# EAGLE design TinyGame RC1_Jig (EAGLE 7.7.0)
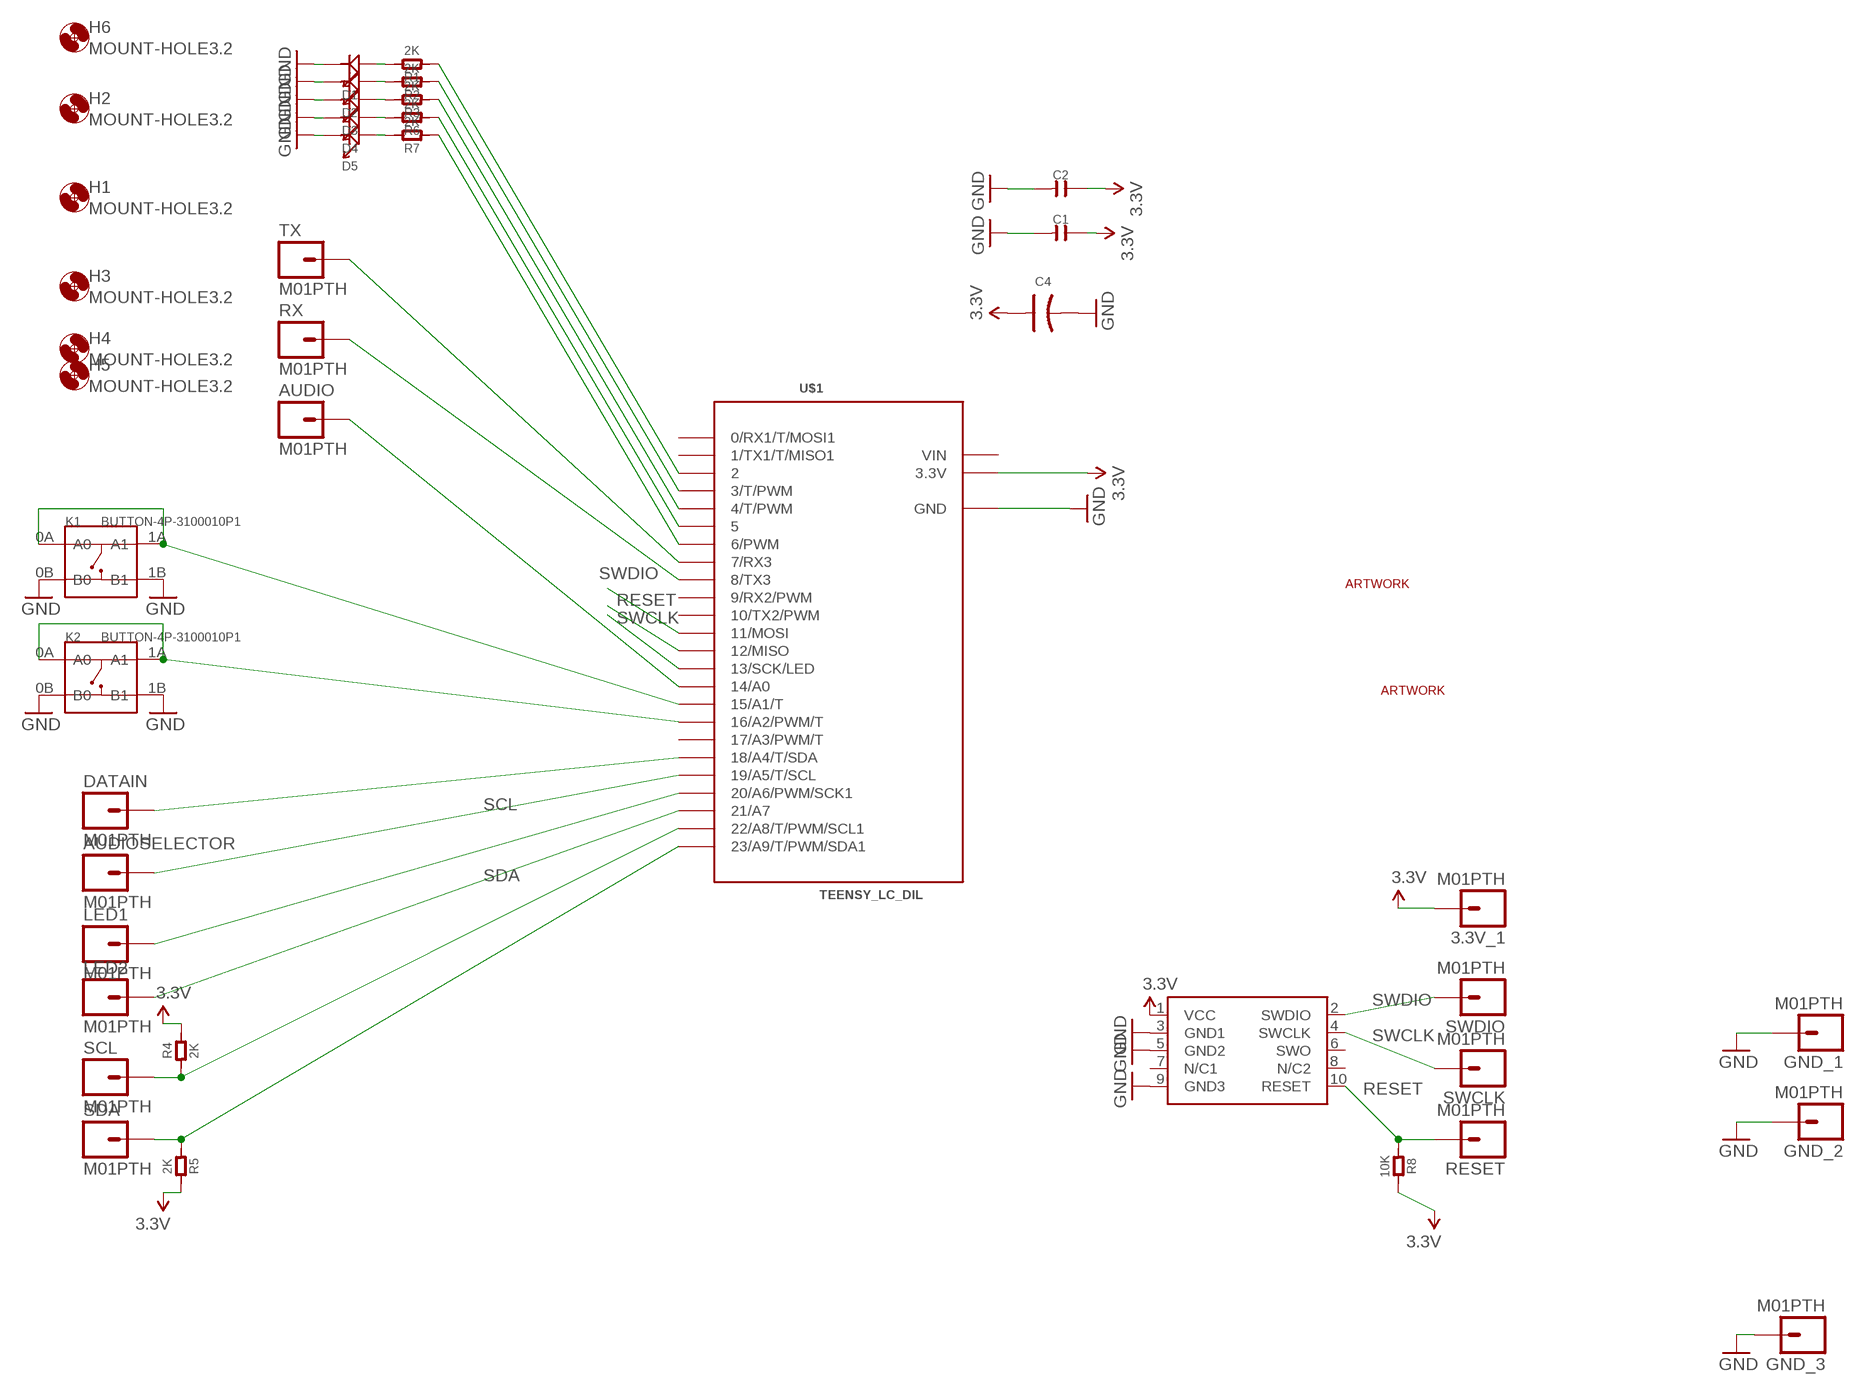
[diagram p0: schematic, sheet 1]

## Parts
3.3V_1  M01PTH  [1X01]
AUDIO  M01PTH  [1X01]
AUDIOSELECTOR  M01PTH  [1X01]
C1  C-0603  [C0603]
C2  C-0603  [C0603]
C4  C-POLAR-A  [AVX-A]
D1  LED  [LED0603]
D2  LED  [LED0603]
D3  LED  [LED0603]
D4  LED  [LED0603]
D5  LED  [LED0603]
DATAIN  M01PTH  [1X01]
GND_1  M01PTH  [1X01]
GND_2  M01PTH  [1X01]
GND_3  M01PTH  [1X01]
H1  MOUNT-HOLE3.2  [3,2]
H2  MOUNT-HOLE3.2  [3,2]
H3  MOUNT-HOLE3.2  [3,2]
H4  MOUNT-HOLE3.2  [3,2]
H5  MOUNT-HOLE3.2  [3,2]
H6  MOUNT-HOLE3.2  [3,2]
K1  BUTTON-4P-3100010P1  [4P-SMD-6.0X6.0X5.0H]
K2  BUTTON-4P-3100010P1  [4P-SMD-6.0X6.0X5.0H]
LED1  M01PTH  [1X01]
LED2  M01PTH  [1X01]
R1  2K  R-0603  [R0603]
R2  2K  R-0603  [R0603]
R3  2K  R-0603  [R0603]
R4  2K  R-0603  [R0603]
R5  2K  R-0603  [R0603]
R6  2K  R-0603  [R0603]
R7  2K  R-0603  [R0603]
R8  10K  R-0603  [R0603]
RESET  M01PTH  [1X01]
RX  M01PTH  [1X01]
SCL  M01PTH  [1X01]
SDA  M01PTH  [1X01]
SWCLK  M01PTH  [1X01]
SWD1  CORTEX_SWDVERT  [SWD_VERTICAL]
SWDIO  M01PTH  [1X01]
TX  M01PTH  [1X01]
U$1  TEENSY_LC_DIL  [TEENSY_3.0-3.2&LC_DIL]
U$2  TINRS_ARTWORKLOGO  [TINRSLOGO]
U$3  TINRS_ARTWORKROCKET  [TINRS_ROCKET]

## Nets
3.3V: 3.3V_1.1 C1.2 C2.2 C4.+ R4.2 R5.2 R8.2 SWD1.1(VCC) U$1.3.3V
GND [GND]: C1.1 C2.1 C4.- D1.- D2.- D3.- D4.- D5.- GND_1.1 GND_2.1 GND_3.1 K1.0B(B0) K1.1B(B1) K2.0B(B0) K2.1B(B1) SWD1.3(GND1) SWD1.5(GND2) SWD1.9(GND3) U$1.AGND(GND) U$1.GND
N$2: TX.1 U$1.7(7/RX3)
N$3: RX.1 U$1.8(8/TX3)
N$4: AUDIO.1 U$1.14/A0
N$6: LED2.1 U$1.21/A7
N$8: LED1.1 U$1.20/A6(20/A6/PWM/SCK1)
N$9: AUDIOSELECTOR.1 U$1.19/A5(19/A5/T/SCL)
N$10: DATAIN.1 U$1.18/A4(18/A4/T/SDA)
N$11: R1.1 U$1.2
N$12: R2.1 U$1.3(3/T/PWM)
N$13: R3.1 U$1.4(4/T/PWM)
N$14: R6.1 U$1.5
N$15: R7.1 U$1.6(6/PWM)
N$16: D1.+ R1.2
N$17: D2.+ R2.2
N$18: D3.+ R3.2
N$19: D4.+ R6.2
N$20: D5.+ R7.2
N$21: K1.0A(A0) K1.1A(A1) U$1.15/A1(15/A1/T)
N$22: K2.0A(A0) K2.1A(A1) U$1.16/A2(16/A2/PWM/T)
RESET: R8.1 RESET.1 SWD1.10(RESET) U$1.12(12/MISO)
SCL: R4.1 SCL.1 U$1.22/A8(22/A8/T/PWM/SCL1)
SDA: R5.1 SDA.1 U$1.23/A9(23/A9/T/PWM/SDA1)
SWCLK: SWCLK.1 SWD1.4(SWCLK) U$1.13(13/SCK/LED)
SWDIO: SWD1.2(SWDIO) SWDIO.1 U$1.11(11/MOSI)
Unconnected: SWD1.6(SWO) SWD1.7(N/C1) SWD1.8(N/C2) U$1.0(0/RX1/T/MOSI1) U$1.1(1/TX1/T/MISO1) U$1.9(9/RX2/PWM) U$1.10(10/TX2/PWM) U$1.17/A3(17/A3/PWM/T)

## Power pins joined to a net without a drawn wire
VIN: U$1.VIN

## Library data of the parts
3.3V_1 AUDIO AUDIOSELECTOR DATAIN GND_1-GND_3 LED1 LED2 RESET RX SCL SDA SWCLK SWDIO TX = SparkFun-Connectors:M01: Header 1 Standard 1-pin 0.1" header. Use with straight break away headers (SKU : PRT-00116), right angle break away headers (PRT-00553), swiss pins (PRT-00743), machine pins (PRT-00117), and female headers (PRT-00115).
C1 C2 = OPL:C*
C4 = OPL:C-POLAR*
D1-D5 = OPL:LED*: LED
H1-H6 = zephod-components:MOUNT-HOLE: MOUNTING HOLE with drill center marker
K1 K2 = OPL:BUTTON-4P
R1-R8 = OPL:R*
SWD1 = carrilib with jtags:CORTEX_SWD: .05" Cortex M Connector in SWD mode Manufacturer: Generic Part Number: Cortex M SWD Notes: I use Harwin M50-3600542 connectors
U$1 = Teensy_3_and_LC_Series_Boards_v1.4:TEENSY_LC_DIL
U$2 U$3 = EurorackModularParts:TINRS_ARTWORK

## Net classes
0 default: clearance 0.178 mm
1 GND: width 0.203 mm, drill 0.203 mm, clearance 0.203 mm

## Board
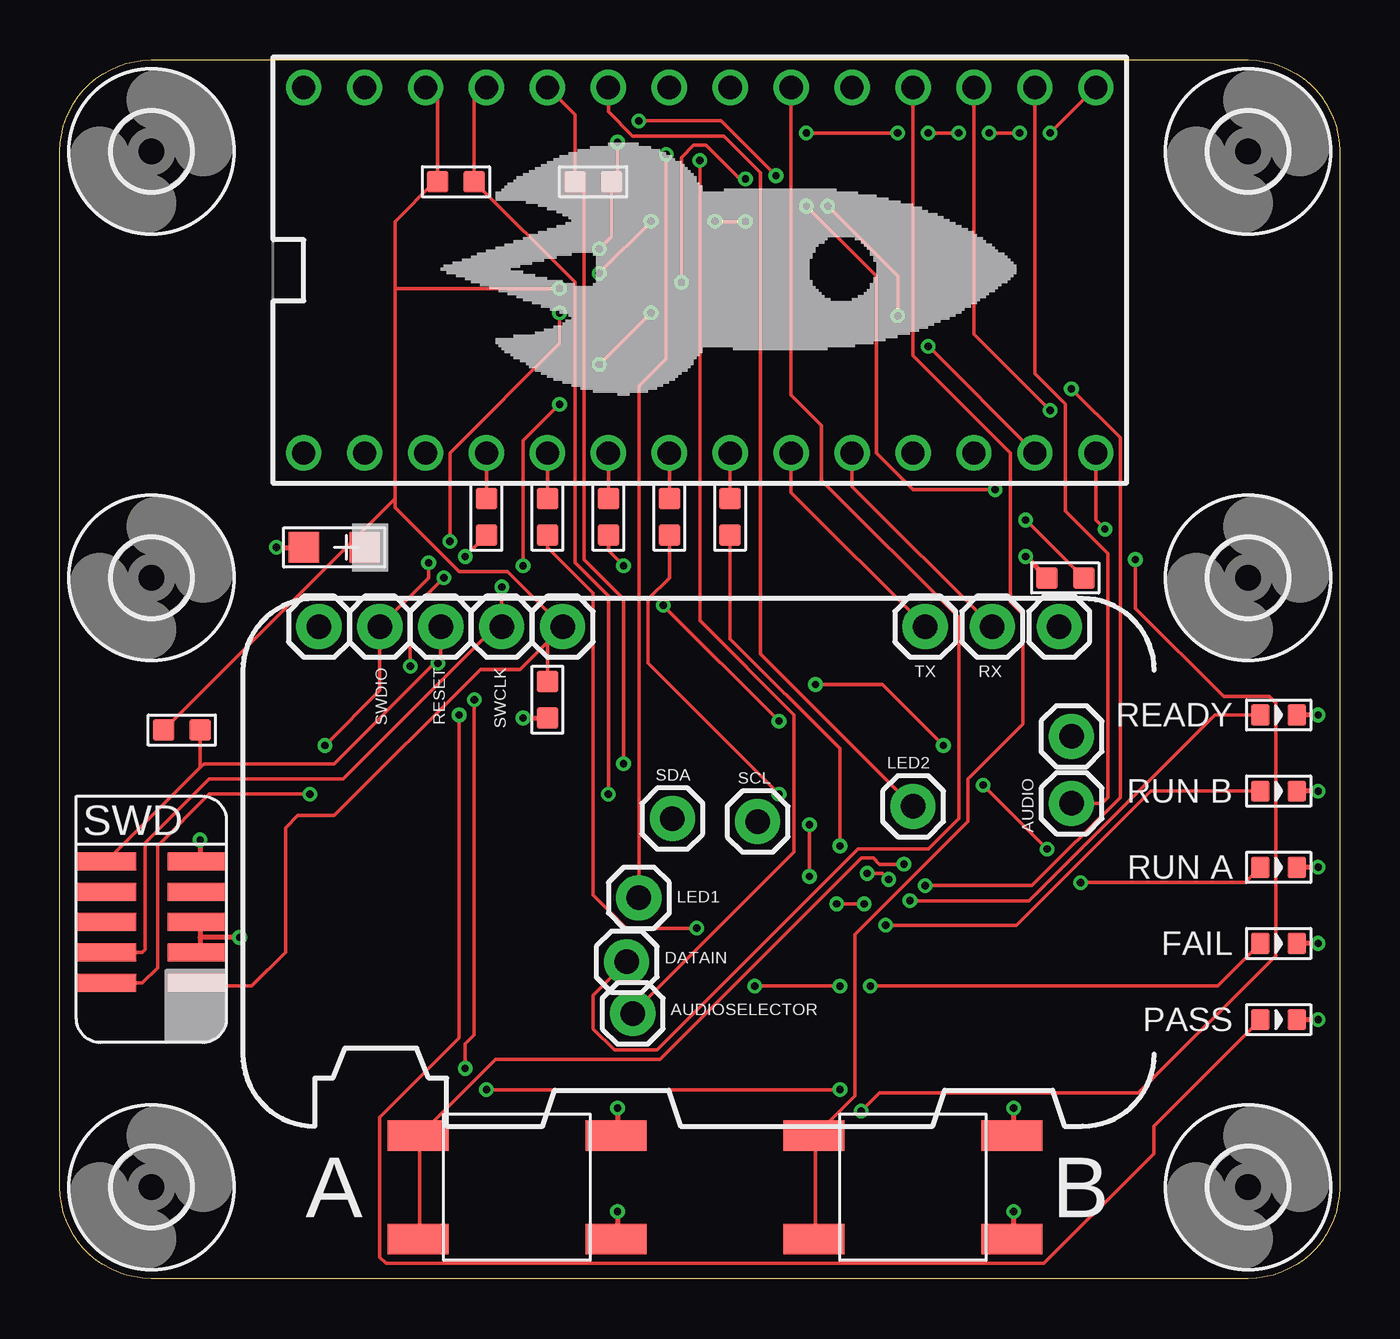
[diagram p1: board, top side]
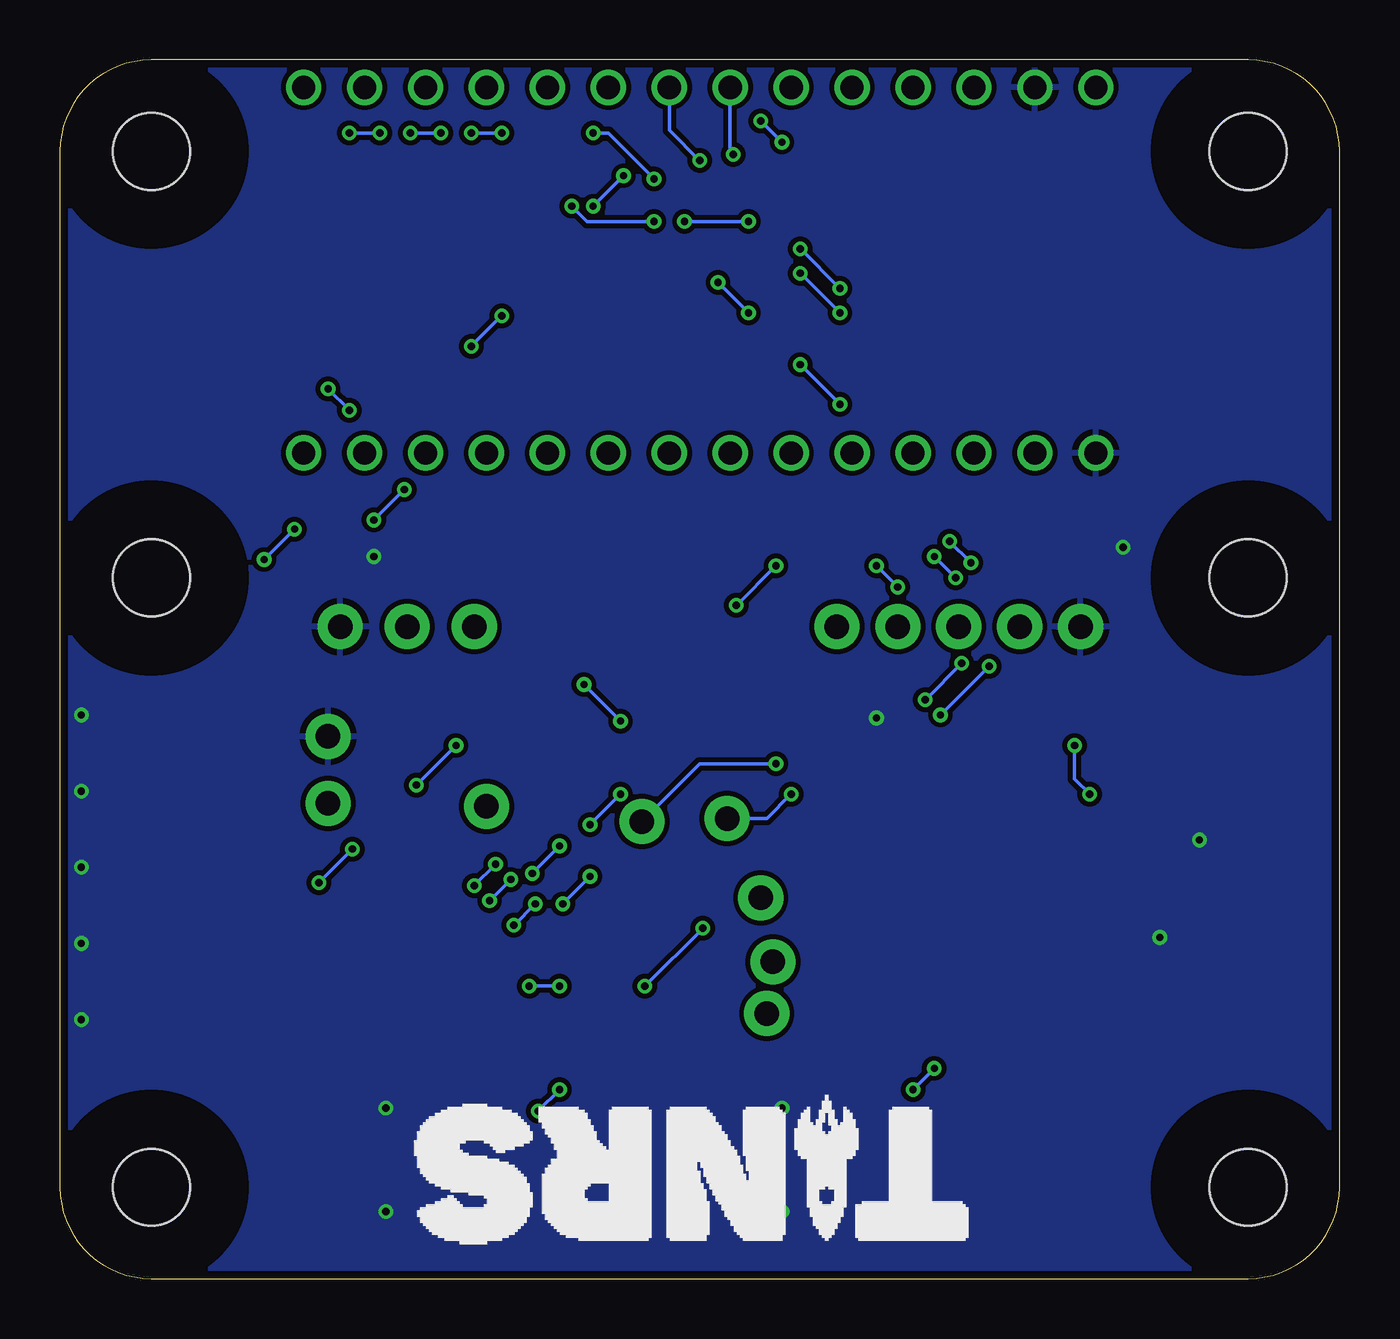
[diagram p2: board, bottom side, seen from below]

Size 53.34 x 50.8 mm. Coordinates in mm from the lower left corner, seen from the top.
Outline: 3.81,50.8 49.53,50.8 arc-90 53.34,46.99 53.34,3.81 arc-90 49.53,0 3.81,0 arc-90 0,3.81 0,46.99 arc-90 3.81,50.8
Copper layers (1*16): Top 0.035mm / dielectric 1.5mm / Bottom 0.035mm
Design rules "ITEADstudio_DRC *": minimum track width 6mil, minimum drill 12mil, track to track 6mil, track to pad 6mil, pad to pad 6mil, via to via 6mil, smd to smd 0mil, copper to edge 13mil, drill to drill 10mil, minimum pad ring 10mil, minimum via ring 6mil, stop-mask expansion 2mil, vias tented up to drill 100mil, thermal gap 10mil

### Footprints (pad centres in the part's own frame; a part is rotated, then mirrored left to right if it is on the bottom)
1X01 = drill 1.016 pad 1.88: 1 0,0
C0603 = smd 0.889 x 0.889: 1 -0.762,0; 2 0.762,0
AVX-A = smd 1.27 x 1.27: + -1.27,0; - 1.27,0
LED0603 = smd 0.762 x 0.889: + -0.762,0; - 0.762,0
3,2 = hole 3.2: 0,0
4P-SMD-6.0X6.0X5.0H = smd 2.54 x 1.27: 0A -4.129,2.159; 0B 4.129,2.159; 1A -4.129,-2.159; 1B 4.129,-2.159
R0603 = smd 0.889 x 0.889: 1 -0.762,0; 2 0.762,0
SWD_VERTICAL = smd 0.75 x 2.5: 1 -2.54,-1.81; 2 -2.54,2; 3 -1.27,-1.81; 4 -1.27,2; 5 0,-1.81; 6 0,2; 7 1.27,-1.81; 8 1.27,2; 9 2.54,-1.81; 10 2.54,2
TEENSY_3.0-3.2&LC_DIL = drill 0.965: 0 -7.62,13.97; 1 -7.62,11.43; 2 -7.62,8.89; 3 -7.62,6.35; 3.3V 7.62,11.43; 4 -7.62,3.81; 5 -7.62,1.27; 6 -7.62,-1.27; 7 -7.62,-3.81; 8 -7.62,-6.35; 9 -7.62,-8.89; 10 -7.62,-11.43; 11 -7.62,-13.97; 12 -7.62,-16.51; 13 7.62,-16.51; 14/A0 7.62,-13.97; 15/A1 7.62,-11.43; 16/A2 7.62,-8.89; 17/A3 7.62,-6.35; 18/A4 7.62,-3.81; 19/A5 7.62,-1.27; 20/A6 7.62,1.27; 21/A7 7.62,3.81; 22/A8 7.62,6.35; 23/A9 7.62,8.89; AGND 7.62,13.97; GND -7.62,16.51; VIN 7.62,16.51

### Placement (x,y rotation side)
3.3V_1  20.96,27.18 0 top
AUDIO  42.16,19.81 0 top
AUDIOSELECTOR  23.88,11.05 0 top
C1  41.91,29.21 0 top
C2  20.32,24.13 90 top
C4  11.43,30.48 180 top
D1  50.8,10.79 0 top
D2  50.8,13.97 0 top
D3  50.8,17.14 0 top
D4  50.8,20.32 0 top
D5  50.8,23.49 0 top
DATAIN  23.62,13.21 0 top
GND_1  42.16,22.61 0 top
GND_2  10.79,27.18 0 top
GND_3  41.66,27.18 0 top
H1  3.81,3.81 0 top
H2  3.81,46.99 0 top
H3  3.81,29.21 0 top
H4  49.53,3.81 0 top
H5  49.53,29.21 0 top
H6  49.53,46.99 0 top
K1  19.05,3.81 0 top
K2  35.56,3.81 0 top
LED1  24.13,15.88 0 top
LED2  35.56,19.69 0 top
R1  17.78,31.75 270 top
R2  20.32,31.75 270 top
R3  22.86,31.75 270 top
R4  22.23,45.72 0 top
R5  16.51,45.72 180 top
R6  25.4,31.75 270 top
R7  27.94,31.75 270 top
R8  5.08,22.86 180 top
RESET  15.88,27.18 0 top
RX  38.86,27.18 0 top
SCL  29.08,19.05 0 top
SDA  25.53,19.18 0 top
SWCLK  18.41,27.18 0 top
SWD1  3.94,14.86 90 top
SWDIO  13.34,27.18 0 top
TX  36.07,27.18 0 top
U$1  26.67,42.04 90 top
U$2  26.92,4.44 180 bottom
U$3  32.64,42.16 0 top

### Tracks (layer width: path | path; a pad name or v marks a point on that pad's centre or on a via)
3.3V  (via drill 0.3)
  Top 0.152: U$1.3.3V 15.75,49.15 R5.2 15.62,45.72 13.97,44.07 13.97,41.27 | SWD1.1 5.87,12.19 8,12.19 9.4,13.59 9.4,18.8 9.91,19.3 11.43,19.3 17.53,25.4 19.18,25.4 20.32,26.54 | 13.97,32.51 13.97,32.13 16.64,29.46 18.67,29.46 3.3V_1.1 20.32,26.54 | 13.97,32.51 13.97,41.27 | v22.48,42.93 22.99,43.43 R4.2 23.24,45.97 v23.24,47.37 | 13.97,41.27 v20.83,41.27 | 13.97,32.51 12.32,30.86 | 12.32,30.86 R8.2 | 20.32,26.54 C2.2 | v40.26,31.62 C1.2 | v38.99,32.89 35.56,32.89 34.04,34.42 34.04,41.78 v31.12,44.7 | v29.85,45.97 27.56,48.26 v24.13,48.26 | 12.32,30.86 C4.+
  Bottom 0.152: v20.83,41.27 v22.48,42.93 | v38.99,32.89 v40.26,31.62 | v29.85,45.97 v31.12,44.7 | v23.24,47.37 v24.13,48.26
GND  (via drill 0.3)
  Top 0.203: 5.84,14.22 5.84,14.86 SWD1.5 | 5.84,14.22 5.84,13.59 SWD1.3 | v52.45,10.79 D1.- | v52.45,13.97 D2.- | v52.45,17.14 D3.- | v52.45,20.32 D4.- | v52.45,23.49 D5.- | v5.84,18.29 5.84,17.4 SWD1.9 | v23.24,2.79 23.24,1.65 K1.1B | v23.24,7.11 23.24,5.97 K1.0B | v39.75,2.79 39.75,1.65 K2.1B | v39.75,7.11 39.75,5.97 K2.0B | v7.49,14.22 5.84,14.22 | v19.3,23.37 C2.1 | v40.26,30.1 C1.1 | v9.02,30.48 C4.-
  pour Bottom: 0,51.44 0,0 53.97,0 53.97,51.44
N$2
  Top 0.152: U$1.7 30.48,32.77 TX.1
N$3
  Top 0.152: U$1.8 33.02,33.02 RX.1
N$4
  Top 0.152: AUDIO.1 43.43,19.81 43.69,20.07 43.69,30.23 41.91,32 41.91,36.45 40.64,37.72 U$1.14/A0
N$6
  Top 0.152: LED2.1 29.21,26.03 29.21,46.1 27.69,47.62 23.88,47.62 22.86,48.64 U$1.21/A7
N$8  (via drill 0.3)
  Top 0.152: LED1.1 24.13,37.21 25.27,38.35 v25.27,46.86
  Bottom 0.152: v25.27,46.86 25.4,46.99 U$1.20/A6
N$9  (via drill 0.3)
  Top 0.152: AUDIOSELECTOR.1 30.61,17.78 30.61,23.49 26.67,27.43 v26.67,46.61
  Bottom 0.152: v26.67,46.61 27.94,47.88 U$1.19/A5
N$10
  Top 0.152: DATAIN.1 22.23,11.81 22.23,10.41 23.11,9.52 24.89,9.52 33.27,17.91 36.2,17.91 37.46,19.18 37.46,27.56 31.75,33.27 31.75,35.56 30.48,36.83 U$1.18/A4
N$11
  Top 0.152: U$1.2 R1.1
N$12
  Top 0.152: U$1.3 R2.1
N$13
  Top 0.152: U$1.4 R3.1
N$14
  Top 0.152: U$1.5 R6.1
N$15
  Top 0.152: U$1.6 R7.1
N$16  (via drill 0.3)
  Top 0.152: v16.89,30.1 R1.2 | v16,29.21 14.61,27.81 v14.61,25.53 | v16.64,23.49 16.64,10.03 13.34,6.73 13.34,0.89 13.59,0.63 41.02,0.63 45.59,5.21 45.59,6.35 D1.+
  Bottom 0.152: v16,29.21 v16.89,30.1 | v16.64,23.49 v14.61,25.53
N$17  (via drill 0.3)
  Top 0.152: R2.2 20.32,30.48 22.23,28.58 22.23,16 23.62,14.61 v26.54,14.61 | v32.51,12.19 v28.96,12.19 | v33.78,12.19 48.26,12.19 D2.+
  Bottom 0.152: v28.96,12.19 v26.54,14.61 | v33.78,12.19 v32.51,12.19
N$18  (via drill 0.3)
  Top 0.152: R3.2 22.86,30.35 v23.5,29.72 | v29.97,23.24 v25.15,28.07 | v31.5,24.77 34.29,24.77 v36.83,22.23 | v41.15,17.91 v38.48,20.57 | v42.54,16.51 49.4,16.51 D3.+
  Bottom 0.152: v25.15,28.07 v23.5,29.72 | v31.5,24.77 v29.97,23.24 | v38.48,20.57 v36.83,22.23 | v42.54,16.51 v41.15,17.91
N$19  (via drill 0.3)
  Top 0.152: R6.2 25.4,29.21 24.51,28.32 24.51,25.65 v29.97,20.19 | v31.24,16.76 v31.24,18.92 | v33.53,15.62 v32.38,15.62 | v34.42,14.73 39.88,14.73 45.47,20.32 D4.+
  Bottom 0.152: v31.24,18.92 v29.97,20.19 | v32.38,15.62 v31.24,16.76 | v34.42,14.73 v33.53,15.62
N$20  (via drill 0.3)
  Top 0.152: R7.2 27.94,26.67 32.51,22.1 v32.51,18.03 | v33.66,16.89 34.29,16.89 v34.54,16.64 | v35.43,15.75 40.39,15.75 48.13,23.49 D5.+
  Bottom 0.152: v33.66,16.89 v32.51,18.03 | v35.43,15.75 v34.54,16.64
N$21  (via drill 0.3)
  Top 0.152: 14.99,5.97 14.99,1.65 K1.1A | U$1.15/A1 38.1,39.37 v41.27,36.2 | v42.16,37.08 44.2,35.05 44.2,20.07 40.51,16.38 v36.07,16.38 | v35.18,17.27 34.16,17.27 33.91,17.53 33.4,17.53 25.02,9.14 18.16,9.14 14.99,5.97 | 14.99,5.97 K1.0A
  Bottom 0.152: v42.16,37.08 v41.27,36.2 | v35.18,17.27 v36.07,16.38
N$22
  Top 0.152: 31.5,5.97 31.5,1.65 K2.1A | U$1.16/A2 35.56,38.48 39.62,34.42 39.62,28.19 40.13,27.69 40.13,23.11 37.85,20.83 37.85,19.05 33.15,14.35 33.15,7.62 31.5,5.97 | 31.5,5.97 K2.0A
RESET  (via drill 0.3)
  Top 0.152: SWD1.10 5.86,21.32 | 5.86,21.32 6,21.46 11.43,21.46 15.62,25.65 | 15.62,25.65 15.88,25.91 RESET.1 | R8.1 5.84,21.34 5.86,21.32 | U$1.12 43.18,31.62 v43.56,31.24 | v44.83,29.97 44.83,27.94 48.51,24.26 50.42,24.26 50.67,24 50.67,13.46 44.96,7.75 34.16,7.75 v33.4,6.98 | v17.78,7.87 v32.51,7.87 | v16.89,8.76 16.89,9.78 17.27,10.16 v17.27,24.13 | 15.62,25.65 v15.75,25.65
  Bottom 0.152: v44.83,29.97 v43.56,31.24 | v32.51,7.87 v33.4,6.98 | v16.89,8.76 v17.78,7.87 | v15.75,25.65 v17.27,24.13
SCL  (via drill 0.3)
  Top 0.152: U$1.22/A8 21.46,48.51 R4.1 21.84,45.34 21.84,29.97 23.5,28.32 v23.5,21.46
  Bottom 0.152: v23.5,21.46 26.67,21.46 SCL.1
SDA  (via drill 0.3)
  Top 0.152: U$1.23/A9 17.27,49.15 R5.1 21.46,41.53 21.46,29.84 22.86,28.45 v22.86,20.19
  Bottom 0.152: v22.86,20.19 23.88,19.18 SDA.1
SWCLK  (via drill 0.3)
  Top 0.152: SWD1.4 3.43,13.59 3.56,13.72 3.56,18.16 6.22,20.83 11.81,20.83 18.16,27.18 SWCLK.1 v18.41,28.83 | v41.27,47.75 U$1.13 | v38.73,47.75 v40,47.75 | v36.2,47.75 v37.46,47.75 | v31.12,47.75 v34.92,47.75 | v28.57,45.85 28.32,45.85 26.92,47.24 26.42,47.24 25.91,46.74 v25.91,41.53 | v22.48,38.1 v24.64,40.26 | v20.83,36.45 19.3,34.92 v19.3,29.72
  Bottom 0.152: v40,47.75 v41.27,47.75 | v37.46,47.75 v38.73,47.75 | v34.92,47.75 v36.2,47.75 | v31.12,47.75 30.48,47.75 v28.57,45.85 | v24.64,40.26 v25.91,41.53 | v20.83,36.45 v22.48,38.1 | v18.41,28.83 v19.3,29.72
SWDIO  (via drill 0.3)
  Top 0.152: SWD1.2 3.43,12.32 4.06,12.95 4.06,18.03 6.22,20.19 v10.41,20.19 | v11.05,22.23 13.34,24.51 SWDIO.1 15.37,29.21 v15.37,29.84 | v36.2,38.86 U$1.11 | v34.92,40.13 34.92,41.78 v32,44.7 | v27.3,44.07 v28.57,44.07 | v22.48,41.91 v24.64,44.07 | v20.83,40.26 20.83,38.99 16.26,34.42 v16.26,30.73
  Bottom 0.152: v10.41,20.19 11.05,20.83 v11.05,22.23 | v34.92,40.13 v36.2,38.86 | v32,44.7 31.37,44.07 v28.57,44.07 | v24.64,44.07 v27.3,44.07 | v20.83,40.26 v22.48,41.91 | v15.37,29.84 v16.26,30.73

### Text on the board
tPlace: READY | RUN B | RUN A | FAIL | PASS | A | B